# Altium schematic sheet PLL.SchDoc
size A3
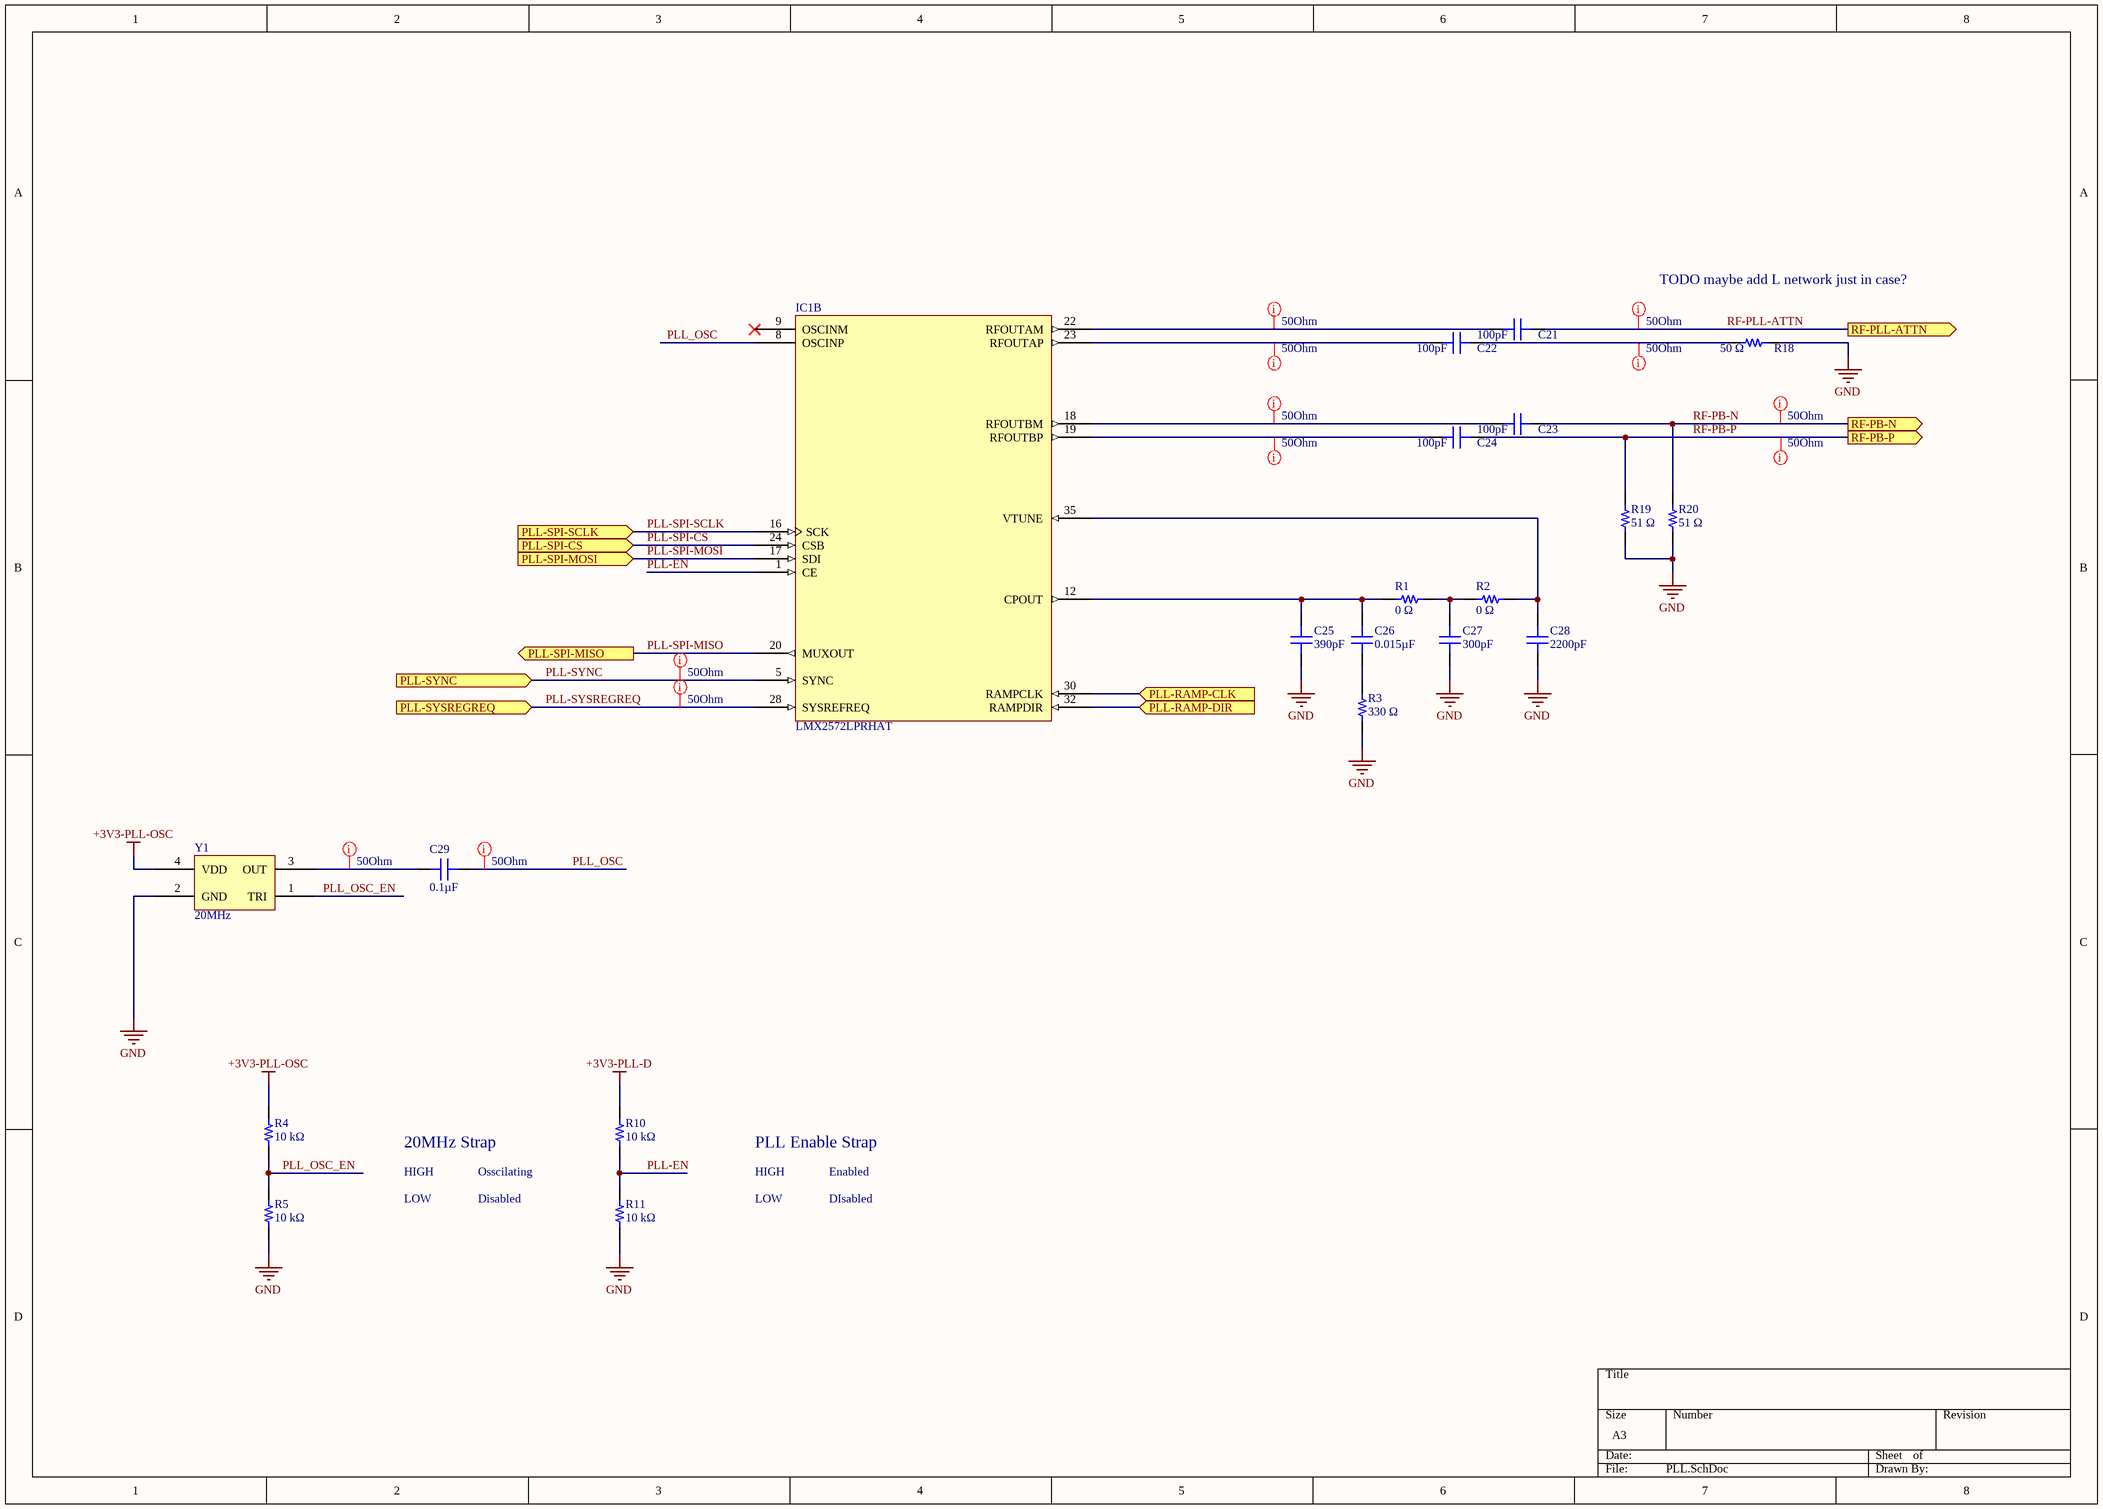
[diagram p0: PLL.SchDoc]

## Parts
C21  100pF  [CAP 0402_1005 RF]
C22  100pF  [CAP 0402_1005 RF]
C23  100pF  [CAP 0402_1005 RF]
C24  100pF  [CAP 0402_1005 RF]
C25  390pF  [CAP 0402_1005]
C26  0.015µF  [CAP 0402_1005]
C27  300pF  [CAP 0402_1005]
C28  2200pF  [CAP 0402_1005]
C29  0.1µF  [CAP 0805_2012 RF]
IC1  LMX2572LPRHAT  [TI VQFN-40 6X6MM]  (part B of 2)
R1  0 Ω  [RES 0402_1005]
R2  0 Ω  [RES 0402_1005]
R3  330 Ω  [RES 0402_1005]
R4  10 kΩ  [RES 0402_1005]
R5  10 kΩ  [RES 0402_1005]
R10  10 kΩ  [RES 0402_1005]
R11  10 kΩ  [RES 0402_1005]
R18  50 Ω  [RES 0603_1608]
R19  51 Ω  [RES 0402_1005]
R20  51 Ω  [RES 0402_1005]
Y1  20MHz  [ABRACON ASE]

## Ports
PLL-RAMP-CLK (in), PLL-RAMP-DIR (in), PLL-SPI-CS (in), PLL-SPI-MISO (out), PLL-SPI-MOSI (in), PLL-SPI-SCLK (in), PLL-SYNC (in), PLL-SYSREGREQ (in), RF-PB-N (out), RF-PB-P (out), RF-PLL-ATTN (out)

## Nets
+3V3-PLL-D: R10.2
+3V3-PLL-OSC: R4.2 Y1.4(VDD)
GND: C25.1 C27.1 C28.1 R3.1 R5.1 R11.1 R18.1 R19.1 R20.1 Y1.2(GND)
PLL-EN: IC1.1(CE) R10.1 R11.2
PLL-RAMP-CLK: IC1.30(RAMPCLK) ; port PLL-RAMP-CLK
PLL-RAMP-DIR: IC1.32(RAMPDIR) ; port PLL-RAMP-DIR
PLL-SPI-CS: IC1.24(CSB) ; port PLL-SPI-CS
PLL-SPI-MISO: IC1.20(MUXOUT) ; port PLL-SPI-MISO
PLL-SPI-MOSI: IC1.17(SDI) ; port PLL-SPI-MOSI
PLL-SPI-SCLK: IC1.16(SCK) ; port PLL-SPI-SCLK
PLL-SYNC: IC1.5(SYNC) ; port PLL-SYNC
PLL-SYSREGREQ: IC1.28(SYSREFREQ) ; port PLL-SYSREGREQ
PLL_OSC: C29.1 IC1.8(OSCINP)
PLL_OSC_EN: R4.1 R5.2 Y1.1(TRI)
RF-PB-N: C23.1 R20.2 ; port RF-PB-N
RF-PB-P: C24.1 R19.2 ; port RF-PB-P
RF-PLL-ATTN: C21.1 ; port RF-PLL-ATTN
NetC21_2: C21.2 IC1.22(RFOUTAM)
NetC22_1: C22.1 R18.2
NetC22_2: C22.2 IC1.23(RFOUTAP)
NetC23_2: C23.2 IC1.18(RFOUTBM)
NetC24_2: C24.2 IC1.19(RFOUTBP)
NetC25_2: C25.2 C26.2 IC1.12(CPOUT) R1.2
NetC26_1: C26.1 R3.2
NetC27_2: C27.2 R1.1 R2.2
NetC28_2: C28.2 IC1.35(VTUNE) R2.1
NetC29_2: C29.2 Y1.3(OUT)

Not connected (* = marked no-connect by the designer): IC1 9(OSCINM)*

## Layout directives
net class 50Ohm: NetC21_2, NetC22_1, NetC22_2, NetC23_2, NetC24_2, NetC29_2, PLL-SYNC, PLL-SYSREGREQ, PLL_OSC, RF-PB-N, RF-PB-P, RF-PLL-ATTN

## Notes on the sheet
- TODO maybe add L network just in case?
- 20MHz Strap
- HIGH
- Osscilating
- PLL Enable Strap
- Enabled
- LOW
- Disabled
- DIsabled

## Library data of the parts
C21-C24 = CBR04C101F3GAC: CAP CER 100PF 25V C0G/NP0 0402; Manufacturer: KEMET; Temperature Coefficient: C0G, NP0; Tolerance: ±1%; Part Number: CBR04C101F3GAC; Applications: RF, Microwave, High Frequency; Capacitance: 100pF; ComponentLink1Description: Datasheet; ComponentLink1URL: https://api.kemet.com/component-edge/download/datasheet/CBR04C101F3GAC.pdf; ComponentLink2Description: DigiKey Link; ComponentLink2URL: http://digikey.com/product-detail/en/kemet/CBR04C101F3GAC/399-11246-1-ND/4376873; Device Package: 0402 (1005 Metric); Features: High Q, Low Loss, Ultra Low ESR; LastUpdated: 2020-02-03 5:10:12 PM; Lifecycle Status: Active; Minimum Order: 1; Mounting Type: Surface Mount, MLCC; Operating Temperature: -55°C ~ 125°C; Package / Case: 0402 (1005 Metric); Packaging: TapeAndReel; Part Status: Active; Price: 0.11; Series: CBR-SMD RF C0G; Size / Dimension: 0.039" L x 0.020" W (1.00mm x 0.50mm); Supplier 1: DigiKey; Supplier Part Number 1: 399-11246-1-ND; Thickness (Max): 0.022" (0.55mm); Value: 100pF; Voltage - Rated: 25V
C25 = 0402B391K500CT: CAP CER 390PF 50V X7R 0402; Manufacturer: Walsin Technology Corporation; Tolerance: ±10%; Part Number: 0402B391K500CT; Applications: General Purpose; Capacitance: 390pF; ComponentLink1Description: Datasheet; ComponentLink1URL: http://www.passivecomponent.com/wp-content/uploads/2018/10/MLCC.pdf; ComponentLink2Description: DigiKey Link; ComponentLink2URL: http://digikey.com/product-detail/en/walsin-technology-corporation/0402B391K500CT/1292-1206-1-ND/9355210; Device Package: 0402 (1005 Metric); LastUpdated: 2020-02-03 5:04:29 PM; Lifecycle Status: Active; Minimum Order: 1; Mounting Type: Surface Mount, MLCC; Operating Temperature: -55°C ~ 125°C; Package / Case: 0402 (1005 Metric); Packaging: TapeAndReel; Part Status: Active; Price: 0.01; Series: -; Size / Dimension: 0.039" L x 0.020" W (1.00mm x 0.50mm); Supplier 1: DigiKey; Supplier Part Number 1: 1292-1206-1-ND; Temperature Coefficient: X7R; Thickness (Max): 0.022" (0.55mm); Value: 390pF; Voltage - Rated: 50V
C26 = 0402YC153JAT2A: CAP CER 0.015UF 16V X7R 0402; Manufacturer: AVX Corporation; Tolerance: ±5%; Part Number: 0402YC153JAT2A; Applications: General Purpose; Capacitance: 0.015µF; ComponentLink1Description: Datasheet; ComponentLink1URL: http://datasheets.avx.com/X7RDielectric.pdf; ComponentLink2Description: DigiKey Link; ComponentLink2URL: http://digikey.com/product-detail/en/avx-corporation/0402YC153JAT2A/478-10175-1-ND/6797549; Device Package: 0402 (1005 Metric); LastUpdated: 2020-02-03 5:04:19 PM; Lifecycle Status: Active; Minimum Order: 1; Mounting Type: Surface Mount, MLCC; Operating Temperature: -55°C ~ 125°C; Package / Case: 0402 (1005 Metric); Packaging: TapeAndReel; Part Status: Active; Price: 0.01; Series: -; Size / Dimension: 0.039" L x 0.020" W (1.00mm x 0.50mm); Supplier 1: DigiKey; Supplier Part Number 1: 478-10175-1-ND; Temperature Coefficient: X7R; Thickness (Max): 0.022" (0.56mm); Value: 0.015µF; Voltage - Rated: 16V
C27 = CC0402KRX7R9BB301: CAP CER 300PF 50V X7R 0402; Manufacturer: Yageo; Tolerance: ±10%; Part Number: CC0402KRX7R9BB301; Applications: General Purpose; Capacitance: 300pF; ComponentLink1Description: Datasheet; ComponentLink1URL: https://www.yageo.com/upload/media/product/productsearch/datasheet/mlcc/UPY-GPHC_X7R_6.3V-to-50V_18.pdf; ComponentLink2Description: DigiKey Link; ComponentLink2URL: http://digikey.com/product-detail/en/yageo/CC0402KRX7R9BB301/311-3814-1-ND/8024903; Device Package: 0402 (1005 Metric); LastUpdated: 2020-02-03 5:04:10 PM; Lifecycle Status: Active; Minimum Order: 1; Mounting Type: Surface Mount, MLCC; Operating Temperature: -55°C ~ 125°C; Package / Case: 0402 (1005 Metric); Packaging: TapeAndReel; Part Status: Active; Price: 0.01; Series: CC; Size / Dimension: 0.039" L x 0.020" W (1.00mm x 0.50mm); Supplier 1: DigiKey; Supplier Part Number 1: 311-3814-1-ND; Temperature Coefficient: X7R; Thickness (Max): 0.022" (0.55mm); Value: 300pF; Voltage - Rated: 50V
C28 = EMF105B7222KVHF: CAP, MLCC, 0402/1005, 16V, X7R,; Manufacturer: Taiyo Yuden; Tolerance: ±10%; Part Number: EMF105B7222KVHF; Applications: Automotive, SMPS Filtering; Capacitance: 2200pF; ComponentLink1Description: Datasheet; ComponentLink1URL: https://ds.yuden.co.jp/TYCOMPAS/ut/detail?pn=EMF105B7222KVHF&u=M; ComponentLink2Description: DigiKey Link; ComponentLink2URL: http://digikey.com/product-detail/en/taiyo-yuden/EMF105B7222KVHF/587-6584-1-ND/10379277; Device Package: 0402 (1005 Metric); LastUpdated: 2020-02-03 5:04:29 PM; Lifecycle Status: Active; Minimum Order: 1; Mounting Type: Surface Mount, MLCC; Operating Temperature: -55°C ~ 125°C; Package / Case: 0402 (1005 Metric); Packaging: TapeAndReel; Part Status: Active; Price: 0.01; Ratings: AEC-Q200; Series: M; Size / Dimension: 0.039" L x 0.020" W (1.00mm x 0.50mm); Supplier 1: DigiKey; Supplier Part Number 1: 587-6584-1-ND; Temperature Coefficient: X7R; Thickness (Max): 0.022" (0.55mm); Value: 2200pF; Voltage - Rated: 16V
C29 = LMK212SD104JG-T: CAP CER 0.1UF 10V 0805; Manufacturer: Taiyo Yuden; Tolerance: ±5%; Part Number: LMK212SD104JG-T; Applications: RF, Microwave, High Frequency; Capacitance: 0.1µF; ComponentLink1Description: Datasheet; ComponentLink1URL: http://www.yuden.co.jp/productdata/catalog/mlcc07_e.pdf; ComponentLink2Description: DigiKey Link; ComponentLink2URL: http://digikey.com/product-detail/en/taiyo-yuden/LMK212SD104JG-T/587-1133-1-ND/930910; Device Package: 0805 (2012 Metric); Features: Low Distortion; LastUpdated: 2020-02-03 5:10:04 PM; Lifecycle Status: Active; Minimum Order: 1; Mounting Type: Surface Mount, MLCC; Operating Temperature: -55°C ~ 125°C; Package / Case: 0805 (2012 Metric); Packaging: TapeAndReel; Part Status: Active; Price: 0.09; Series: CFCAP™; Size / Dimension: 0.079" L x 0.049" W (2.00mm x 1.25mm); Supplier 1: DigiKey; Supplier Part Number 1: 587-1133-1-ND; Thickness (Max): 0.053" (1.35mm); Value: 0.1µF; Voltage - Rated: 10V
IC1 = LMX2572LPRHAT: IC FREQUENCY SYNTH 40VQFN; Manufacturer: Texas Instruments; Frequency - Max: 2GHz; Differential - Input:Output: Yes/Yes; Ratio - Input:Output: 1:2; PLL: Yes; Voltage - Supply: 3 ~ 3.5V; Part Number: LMX2572LPRHAT; ComponentLink1Description: Datasheet; ComponentLink1URL: http://www.ti.com/general/docs/suppproductinfo.tsp?distId=10&gotoUrl=http%3A%2F%2Fwww.ti.com%2Flit%2Fgpn%2Flmx2572lp; ComponentLink2Description: DigiKey Link; ComponentLink2URL: https://www.digikey.com/en/products/detail/texas-instruments/LMX2572LPRHAT/9593375; Device Package: Tape & Reel; Output: -; Driver/Multiplier: Yes/Yes; LastUpdated: 2021-02-16 1:51:24 AM; Lifecycle Status: Active; Minimum Order: 1; Mounting Type: Surface Mount; Part Status: 1; Price: 13.52; Supplier 1: DigiKey; Supplier Part Number 1: 296-51375-2-ND
R1 R2 = RCA04020000ZSED: RES SMD 0 OHM JUMPER 1/16W 0402; Manufacturer: Vishay Dale; Power (Watts): 0.063W, 1/16W; Value: 0 Ohms; Part Number: RCA04020000ZSED; ComponentLink1Description: Datasheet; ComponentLink1URL: http://www.vishay.com/docs/20037/rcae3.pdf; ComponentLink2Description: DigiKey Link; ComponentLink2URL: http://digikey.com/product-detail/en/vishay-dale/RCA04020000ZSED/541-2174-1-ND/4946827; Composition: Thick Film; Device Package: 0402 (1005 Metric); Features: Anti-Sulfur, Automotive AEC-Q200; Height - Seated (Max): 0.016" (0.40mm); LastUpdated: 2020-02-19 6:28:05 AM; Lifecycle Status: Active; Minimum Order: 1; Number of Terminations: 2; Operating Temperature: -55°C ~ 155°C; Package / Case: 0402 (1005 Metric); Packaging: TapeAndReel; Part Status: Active; Price: 0.01; Ratings: AEC-Q200; Resistance: 0 Ω; Series: RCA; Size / Dimension: 0.039" L x 0.020" W (1.00mm x 0.50mm); Supplier 1: DigiKey; Supplier Part Number 1: 541-2174-1-ND; Supplier Device Package: 0402; Tolerance: Jumper
R3 = CR0402-FX-3300GLF: RES SMD 330 OHM 1% 1/16W 0402; Manufacturer: Bourns Inc.; Power (Watts): 0.063W, 1/16W; Temperature Coefficient: ±100ppm/°C; Value: 330 Ohms; Part Number: CR0402-FX-3300GLF; ComponentLink1Description: Datasheet; ComponentLink1URL: https://www.bourns.com/docs/Product-Datasheets/CR0402.pdf; ComponentLink2Description: DigiKey Link; ComponentLink2URL: http://digikey.com/product-detail/en/bourns-inc/CR0402-FX-3300GLF/CR0402-FX-3300GLFCT-ND/8601901; Composition: Thick Film; Device Package: 0402 (1005 Metric); Height - Seated (Max): 0.016" (0.40mm); LastUpdated: 2020-02-19 6:28:05 AM; Lifecycle Status: Active; Minimum Order: 1; Number of Terminations: 2; Operating Temperature: -55°C ~ 155°C; Package / Case: 0402 (1005 Metric); Packaging: TapeAndReel; Part Status: Active; Price: 0.01; Resistance: 330 Ω; Series: CR0402; Size / Dimension: 0.039" L x 0.020" W (1.00mm x 0.50mm); Supplier 1: DigiKey; Supplier Part Number 1: CR0402-FX-3300GLFCT-ND; Supplier Device Package: 0402; Tolerance: ±1%
R4 R5 R10 R11 = ASC0402-10KF1: RES 10 KOHM 1% 1/16W 0402; Manufacturer: Riedon; Power (Watts): 0.063W, 1/16W; Temperature Coefficient: ±100ppm/°C; Value: 10 kOhms; Part Number: ASC0402-10KF1; ComponentLink1Description: Datasheet; ComponentLink1URL: https://riedon.com/media/pdf/ASC.pdf; ComponentLink2Description: DigiKey Link; ComponentLink2URL: http://digikey.com/product-detail/en/riedon/ASC0402-10KF1/696-1775-1-ND/7398745; Composition: Thick Film; Device Package: 0402 (1005 Metric); Features: Anti-Sulfur, Automotive AEC-Q200, Moisture Resistant; Height - Seated (Max): 0.016" (0.40mm); LastUpdated: 2020-02-19 6:28:05 AM; Lifecycle Status: Active; Minimum Order: 1; Number of Terminations: 2; Operating Temperature: -55°C ~ 155°C; Package / Case: 0402 (1005 Metric); Packaging: TapeAndReel; Part Status: Active; Price: 0.01; Ratings: AEC-Q200; Resistance: 10 kΩ; Series: ASC; Size / Dimension: 0.039" L x 0.020" W (1.00mm x 0.50mm); Supplier 1: DigiKey; Supplier Part Number 1: 696-1775-1-ND; Supplier Device Package: 0402; Tolerance: ±1%
R18 = RCP0603W50R0GEB: RES SMD 50 OHM 2% 1.5W 0603; Manufacturer: Vishay Dale; Temperature Coefficient: ±150ppm/°C; Value: 50 Ohms; Part Number: RCP0603W50R0GEB; ComponentLink1Description: Datasheet; ComponentLink1URL: http://www.vishay.com/docs/31098/rcp.pdf; ComponentLink2Description: DigiKey Link; ComponentLink2URL: http://digikey.com/product-detail/en/vishay-dale/RCP0603W50R0GEB/541-2655-1-ND/5481885; Composition: Thick Film; Device Package: 0603 (1608 Metric); Features: Moisture Resistant; Height - Seated (Max): 0.023" (0.58mm); LastUpdated: 2020-02-19 6:28:06 AM; Lifecycle Status: Active; Minimum Order: 1; Number of Terminations: 2; Operating Temperature: -65°C ~ 155°C; Package / Case: 0603 (1608 Metric); Packaging: TapeAndReel; Part Status: Active; Power (Watts): 1.5W; Price: 0.87; Resistance: 50 Ω; Series: RCP; Size / Dimension: 0.063" L x 0.032" W (1.60mm x 0.81mm); Supplier 1: DigiKey; Supplier Part Number 1: 541-2655-1-ND; Supplier Device Package: 0603; Tolerance: ±2%
R19 R20 = ERJ-PA2F51R0X: RES SMD 51 OHM 1% 1/5W 0402; Manufacturer: Panasonic Electronic Components; Power (Watts): 0.2W, 1/5W; Temperature Coefficient: ±100ppm/°C; Value: 51 Ohms; Part Number: ERJ-PA2F51R0X; ComponentLink1Description: Datasheet; ComponentLink1URL: https://industrial.panasonic.com/cdbs/www-data/pdf/RDO0000/AOA0000C331.pdf; ComponentLink2Description: DigiKey Link; ComponentLink2URL: http://digikey.com/product-detail/en/panasonic-electronic-components/ERJ-PA2F51R0X/P124491CT-ND/10271467; Composition: Thick Film; Device Package: 0402 (1005 Metric); Features: Automotive AEC-Q200, Pulse Withstanding; Height - Seated (Max): 0.016" (0.40mm); LastUpdated: 2020-02-19 6:28:05 AM; Lifecycle Status: Active; Minimum Order: 1; Number of Terminations: 2; Operating Temperature: -55°C ~ 155°C; Package / Case: 0402 (1005 Metric); Packaging: TapeAndReel; Part Status: Active; Price: 0.02; Ratings: AEC-Q200; Resistance: 51 Ω; Series: ERJ; Size / Dimension: 0.039" L x 0.022" W (1.00mm x 0.55mm); Supplier 1: DigiKey; Supplier Part Number 1: P124491CT-ND; Supplier Device Package: 0402; Tolerance: ±1%
Y1 = ASE-20.000MHZ-ET: XTAL OSC XO 20.0000MHZ CMOS SMD; Manufacturer: Abracon LLC; Base Resonator: Crystal; Current - Supply (Max): 7mA; Frequency Stability: ±100ppm; Function: Enable/Disable; Voltage - Supply: 3.3V; Part Number: ASE-20.000MHZ-ET; ComponentLink1Description: Datasheet; ComponentLink1URL: https://abracon.com/Oscillators/ASEseries.pdf; ComponentLink2Description: DigiKey Link; ComponentLink2URL: http://digikey.com/product-detail/en/abracon-llc/ASE-20.000MHZ-ET/535-9983-1-ND/2001606; Device Package: 4-SMD, No Lead; Frequency: 20MHz; Height - Seated (Max): 0.047" (1.20mm); LastUpdated: 2020-02-03 5:17:12 PM; Lifecycle Status: Active; Minimum Order: 1; Mounting Type: Surface Mount; Operating Temperature: -20°C ~ 70°C; Output: CMOS; Package / Case: 4-SMD, No Lead; Packaging: TapeAndReel; Part Status: Active; Price: 0.94; Series: ASE; Size / Dimension: 0.126" L x 0.098" W (3.20mm x 2.50mm); Supplier 1: DigiKey; Supplier Part Number 1: 535-9983-1-ND; Type: XO (Standard); Value: 20MHz